# EasyEDA Pro project ProPrj_默语小智管家（ESP32版）_2025-03-15.epro, board PCB_默语小智管家ESP32扩展板
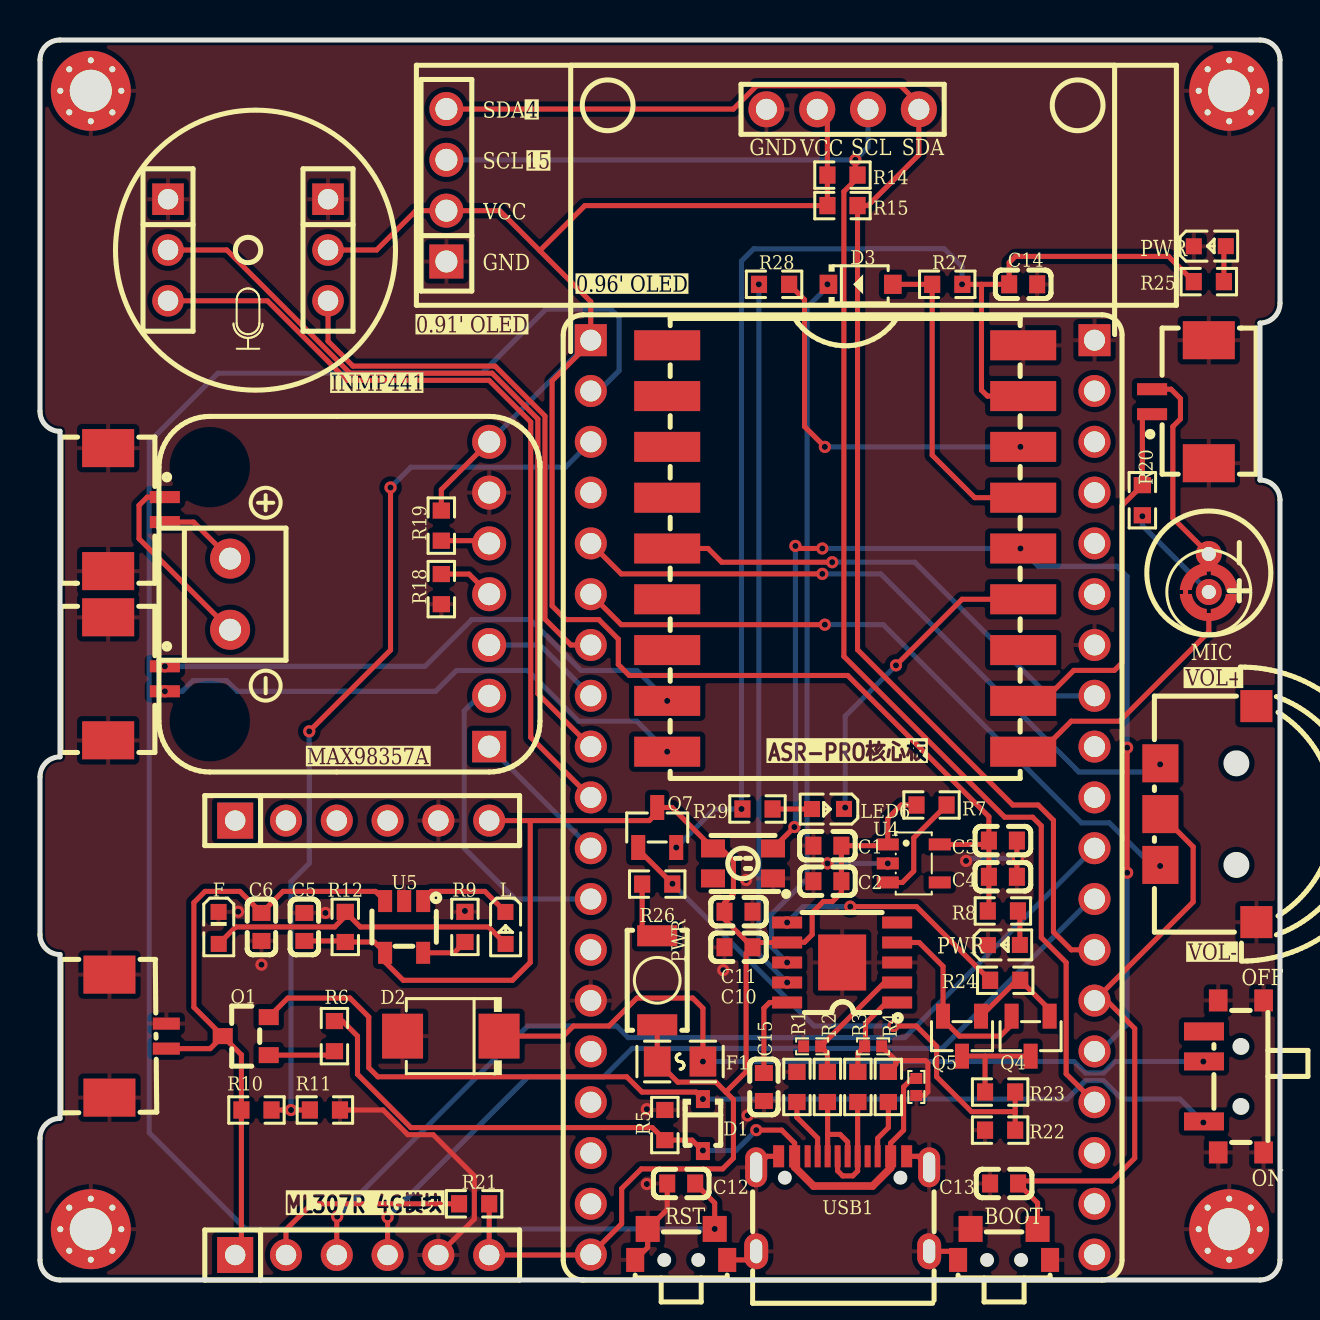
[diagram p5: board, top side]
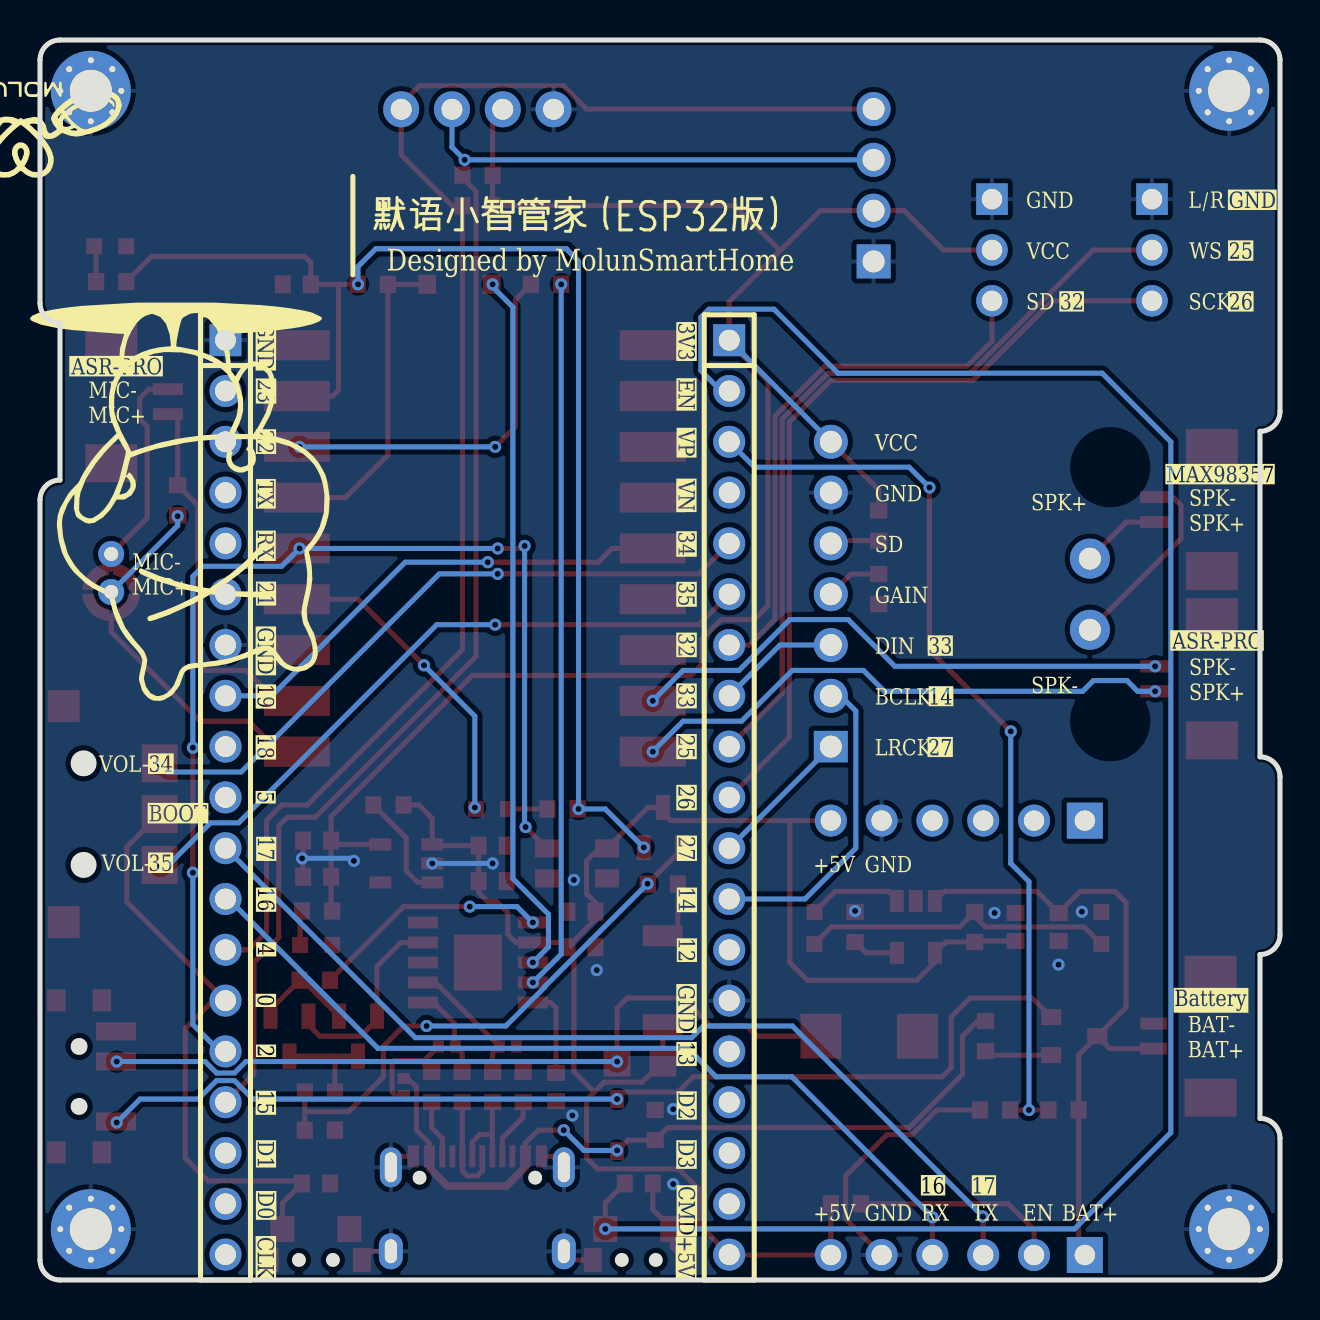
[diagram p6: board, bottom side, seen from below]

Outline 62 x 62 mm; copper layers: Top Layer, Bottom Layer. Coordinates in mm from the lower left corner of the outline.
Outline path: 0,61 0,43.43 arc(0.29,42.73) 1,42.43 1,26.16 arc(0.29,25.86) 0,25.16 0,17.27 arc(0.29,16.56) 1,16.27 1,8.08 arc(0.29,7.79) 0,7.08 0,1 arc(0.29,0.29) 1,0 61,0 arc(61.71,0.29) 62,1 62,39 arc(61.71,39.7) 61,40 61,47.85 arc(61.71,48.14) 62,48.85 62,61 arc(61.71,61.71) 61,62 1,62 arc(0.29,61.71) 0,61
Stack: Top Layer 0.035mm / Dielectric1 1.51mm FR4 er 4.5 / Bottom Layer 0.035mm

## Design rules (mm)
template: JLCPCB Capability(Two Layers Board)
spacing copperThickness1oz (default): track to track 0.102, other pairs 0.152 to 0.3
spacing copperThickness2oz: track to track 0.203, other pairs 0.152 to 0.3
track width copperThickness1oz (default): min 0.127, default 0.254, max 2.54
track width copperThickness2oz: min 0.203, default 0.254, max 2.54
differential pair differentialPair (default): width min 0.127, default 0.254, max 2.54; gap min 0.152, default 0.152
via viaSize (default): diameter min 0.5, default 0.61, max 10; hole min 0.3, default 0.305, max 6.3

## Placement (name value [footprint] x y rotation side)
BOOT1  TS24CA  [SW-SMD_TS24CA]  48.2 1.78 180 top
C1  10uF  [C0603]  39.37 21.72 0 top
C2  100nF  [C0603]  39.37 19.94 180 top
C3  10uF  [C0603]  48.14 21.97 180 top
C4  100nF  [C0603]  48.14 20.16 0 top
C5  4.7uF  [C0603]  13.22 17.65 270 top
C6  10uF  [C0603]  11.07 17.65 90 top
C10  100nF  [C0603]  34.93 16.64 180 top
C11  100nF  [C0603]  34.93 18.42 180 top
C12  100nF  [C0603]  32.06 4.83 180 top
C13  100nF  [C0603]  48.2 4.83 180 top
C14  4.7uF  [C0603]  49.16 49.78 0 top
C15  100nF  [C0603]  36.19 9.65 270 top
CN1  PZ254V-11-19P  [HDR-TH_19P-P2.54-V-M]  27.54 24.13 270 bottom
CN2  PZ254V-11-19P  [HDR-TH_19P-P2.54-V-M]  52.72 24.13 270 bottom
CN3  AFC12-S02DCC-00  [CONN-SMD_AFC12-S02DCC-00]  4.83 38.52 270 top
CN4  AFC12-S02DCC-00  [CONN-SMD_AFC12-S02DCC-00]  4.83 30.06 270 top
CN5  AFC12-S02DCC-00  [CONN-SMD_AFC12-S02DCC-00]  57.02 43.92 90 top
D1  1N5819WS S4  [SOD-323_L1.6-W1.3-LS2.7-RD]  33.15 7.75 270 top
D2  SMBJ5339B  [SMB_L4.6-W3.6-LS5.4-RD]  20.54 12.19 180 top
D3  1N4148W  [SOD-123_L2.7-W1.6-LS3.7-FD]  41.03 49.78 180 top
F  XL-1608PGC-06  [LED0603-RD_GREEN]  8.93 17.6 270 top
F1  BSMD0805-050-6V  [F0805]  32 10.92 180 top
H1  PM254V-11-04-H85  [HDR-TH_4P-P2.54-V-F]  20.32 54.74 90 top
H2  PM254V-11-07-H85  [HDR-TH_7P-P2.54-V-F]  22.46 34.29 90 top
H3  PM254V-11-03-H85  [HDR-TH_3P-P2.54-V-F]  6.4 51.5 270 top
H4  PM254V-11-03-H85  [HDR-TH_3P-P2.54-V-F]  14.4 51.5 270 top
H7  PM254V-11-06-H85  [HDR-TH_6P-P2.54-V-F]  16.11 1.25 0 top
H8  PM254V-11-06-H85  [HDR-TH_6P-P2.54-V-F]  16.11 22.97 0 top
HOLE4  -  [m3 125x300]  2.54 2.54 0 top
HOLE4#2  -  [m3 125x300]  59.46 2.54 0 top
HOLE4#3  -  [m3 125x300]  59.46 59.46 0 top
HOLE4#4  -  [m3 125x300]  2.54 59.46 0 top
L  XL-1608SURC-06  [LED0603-RD_RED]  23.27 17.6 270 top
LED1  XL-1608SURC-06  [LED0603-RD_RED]  48.19 16.75 0 top
LED4  XL-3528RGBW-WS2812B  [LED-SMD_4P-L3.5-W2.8-BR-1]  35.15 20.83 0 top
LED5  XL-1608SURC-06  [LED0603-RD_RED]  58.49 51.69 0 top
LED6  XL-1608SURC-06  [LED0603-RD_RED]  39.4 23.55 180 top
MIC1  GMI6050P-66DB  [MIC-TH_BD6.0-P1.90-D0.4-L-RD]  58.44 35.35 90 top
OLED1  HS91L02W2C01  [OLED-TH_L38.0-W12.0_HS91L02W2C01]  20.32 54.74 0 top
PWR  TS-3425SG  [KEY-SMD_L3.9-W3.0-LS5.0_1]  30.86 14.99 90 top
Q1  AO3401A  [SOT-23_L2.9-W1.3-P1.90-LS2.4-BR]  10.29 12.19 0 top
Q4  SS8550  [SOT-23-3_L2.9-W1.3-P1.90-LS2.4-BR]  49.53 12.19 90 top
Q5  SS8550  [SOT-23-3_L2.9-W1.3-P1.90-LS2.4-BR]  46.1 12.19 90 top
Q7  LP2301LT1G  [SOT-23-3_L2.9-W1.3-P1.90-LS2.4-BR]  30.86 22.62 270 top
R1  5.1kΩ  [R0603]  37.85 9.65 90 top
R2  33Ω  [R0603]  39.37 9.65 90 top
R3  33Ω  [R0603]  40.89 9.65 90 top
R4  5.1kΩ  [R0603]  42.42 9.65 90 top
R5  100kΩ  [R0603]  31.24 7.75 270 top
R6  100kΩ  [R0603]  14.72 12.19 270 top
R7  10kΩ  [R0603]  44.58 23.75 0 top
R8  4.7kΩ  [R0603]  48.14 18.45 0 top
R9  2kΩ  [R0603]  21.25 17.65 270 top
R10  300kΩ  [R0603]  10.82 8.5 0 top
R11  100kΩ  [R0603]  14.25 8.5 0 top
R12  1kΩ  [R0603]  15.26 17.65 270 top
R14  4.7kΩ  [R0603]  40.12 55.25 0 top
R15  4.7kΩ  [R0603]  40.12 53.72 0 top
R18  0Ω  [R0603]  20.07 34.54 90 top
R19  0Ω  [R0603]  20.07 37.72 270 top
R20  0Ω  [R0603]  55.12 38.99 270 top
R21  4.7kΩ  [R0603]  21.71 3.81 180 top
R22  47kΩ  [R0603]  48.01 7.49 0 top
R23  330Ω  [R0603]  48.01 9.4 0 top
R24  2.2kΩ  [R0603]  48.26 14.99 0 top
R25  2.2kΩ  [R0603]  58.44 49.92 180 top
R26  2.2kΩ  [R0603]  30.86 19.8 0 top
R27  4.7kΩ  [R0603]  45.36 49.78 180 top
R28  330Ω  [R0603]  36.7 49.78 180 top
R29  4.7kΩ  [R0603]  35.87 23.55 0 top
RST1  TS24CA  [SW-SMD_TS24CA]  32.06 1.78 180 top
SW1  MK-12C02-G020  [SW-SMD_MK-12C02-G020]  59.69 10.18 90 top
SW3  K1-1502SA-01  [KEY-SMD_K1-1502SA-01]  58.42 23.29 270 top
U1  RCLAMP0521T-ES  [DFN1006-2L-BI]  43.81 9.65 90 top
U2  RCLAMP0521T-ES  [DFN1006-2L-BI]  38.61 11.68 0 top
U3  RCLAMP0521T-ES  [DFN1006-2L-BI]  41.66 11.68 180 top
U4  ME6217C33M5G  [SOT-23-5_L3.0-W1.7-P0.95-LS2.8-BR]  43.69 20.83 180 top
U5  TP4054  [TSOT-23-5_L2.9-W1.6-P0.95-LS2.8-BR]  18.21 17.65 90 top
U7  CH340K  [ESOP-10_L4.9-W3.9-P1.00-LS6.2-BL-EP]  40.11 15.88 90 top
U8  HS96L03W2C03  [OLED-TH_L27.8-W27.2-P2.54_C9900033791]  40.13 58.53 0 top
U10  MAX98357A  [max98357 i2s amp module]  22.46 34.29 180 top
U11  -  [INMP441]  10.4 51.5 0 top
U12  ASRPRO-CORE  [COMM-SMD_ASRPRO-CORE-V1.1]  40.26 36.58 0 top
U13  ESP32-WROVER-IE-N16R8  [MIC-SMD_BD4.0_B4013AM423-008]  58.44 34.4 0 top
USB1  TYPE-C 16PIN 2MD(073)  [USB-C-SMD_TYPE-C-6PIN-2MD-073]  40.13 3.81 0 top
X1  AFC12-S02DCA-00  [SMD_2P-P1.25]  4.89 12.19 270 top

## Footprints (pads in the part's own frame, mm; a bottom-side part is the same pattern mirrored in y, then rotated)
C0603
  rect 0.8x0.9 smd: 1(-0.7,0) 2(0.7,0)
COMM-SMD_ASRPRO-CORE-V1.1
  rect 3.3x1.5 smd: 1(-8.9,10.16) 2(-8.9,7.62) 3(-8.9,5.08) 4(-8.9,2.54) 5(-8.9,0) 6(-8.9,-2.54) 7(-8.9,-5.08) 8(-8.9,-7.62) 9(-8.9,-10.16) 10(8.9,-10.16) 11(8.9,-7.62) 12(8.9,-5.08) 13(8.9,-2.54) 14(8.9,0) 15(8.9,2.54) 16(8.9,5.08) 17(8.9,7.62) 18(8.9,10.16)
CONN-SMD_AFC12-S02DCC-00
  rect 0.6x1.5 smd: 1(-0.625,1.417) 2(0.625,1.417)
  rect 1.9x2.6 smd: 3(3.075,-1.417) 4(-3.075,-1.417)
DFN1006-2L-BI
  rect 0.55x0.6 smd: 1(-0.425,0) 2(0.425,0)
ESOP-10_L4.9-W3.9-P1.00-LS6.2-BL-EP
  rect 0.6x1.5 smd: 1(-2,-2.75) 2(-1,-2.75) 3(0,-2.75) 4(1,-2.75) 5(2,-2.75) 6(2,2.75) 7(1,2.75) 8(0,2.75) 9(-1,2.75) 10(-2,2.75)
  rect 2.8x2.4 smd: 11(0,0)
F0805
  rect 1.335x1.5 smd: 1(-1.143,0) 2(1.143,0)
HDR-TH_3P-P2.54-V-F
  rect 1.575x1.575 hole 1.02: 1(-2.54,0)
  round 1.575 hole 1.02: 2(0,0) 3(2.54,0)
HDR-TH_4P-P2.54-V-F
  rect 1.7x1.7 hole 1.1: 1(-3.81,0)
  round 1.7 hole 1.1: 2(-1.27,0) 3(1.27,0) 4(3.81,0)
HDR-TH_6P-P2.54-V-F
  rect 1.8x1.8 hole 1.02: 1(-6.35,0)
  round 1.6 hole 1.02: 2(-3.81,0) 3(-1.27,0) 4(1.27,0) 5(3.81,0) 6(6.35,0)
HDR-TH_7P-P2.54-V-F
  rect 1.575x1.7 hole 1.1: 1(-7.62,0)
  round 1.7 hole 1.1: 2(-5.08,0) 3(-2.54,0) 4(0,0) 5(2.54,0) 6(5.08,0) 7(7.62,0)
HDR-TH_19P-P2.54-V-M
  rect 1.6x1.6 hole 1.05: 1(-22.86,0)
  round 1.6 hole 1.05: 2(-20.32,0) 3(-17.78,0) 4(-15.24,0) 5(-12.7,0) 6(-10.16,0) 7(-7.62,0) 8(-5.08,0) 9(-2.54,0) 10(0,0) 11(2.54,0) 12(5.08,0) 13(7.62,0) 14(10.16,0) 15(12.7,0) 16(15.24,0) 17(17.78,0) 18(20.32,0) 19(22.86,0)
INMP441
  round 1.524 hole 0.914: 1(4,2.54) 2(4,0) 3(4,-2.54) 4(-4,2.54) 5(-4,0) 6(-4,-2.54)
KEY-SMD_K1-1502SA-01
  rect 1.9x1.8 smd: 1(-2.54,-2.4) 2(2.54,-2.4) T(0,-2.4)
  rect 1.6x1.6 smd: 5(-5.4,2.4) C(5.4,2.4)
KEY-SMD_L3.9-W3.0-LS5.0_1
  rect 1.05x2 smd: 1(-2.225,0) 2(2.225,0)
LED0603-RD_GREEN
  rect 0.8x0.8 smd: 1(-0.799,-0.004) 2(0.799,0.004)
LED0603-RD_RED
  rect 0.8x0.8 smd: 1(-0.799,-0.004) 2(0.799,0.004)
LED-SMD_4P-L3.5-W2.8-BR-1
  rect 1.2x0.9 smd: 1(1.5,-0.75) 2(1.5,0.75) 3(-1.5,0.75) 4(-1.5,-0.75)
m3 125x300
  round 0.61 hole 0.305: 1(-1.524,0) 1(-1.077,-1.077) 2(0,-1.524) 3(1.077,-1.077) 4(1.524,0) 5(1.077,1.077) 6(0,1.524) 7(-1.077,1.077)
  round 4 hole 2.1: 1(0,0)
max98357 i2s amp module
  round 1.524 hole 0.914: 1(0,7.62) 2(0,5.08) 3(0,2.54) 4(0,0) 5(0,-2.54) 6(0,-5.08) 7(0,-7.62)
  round 2 hole 1.1: 8(12.954,-1.778) 9(12.954,1.778)
MIC-SMD_BD4.0_B4013AM423-008
  round 0.9 smd: 1(0,0)
  custom 1.35x1.35 smd: 2(-0.798,0.775) 2(-0.775,-0.798) 2(0.775,0.798) 2(0.798,-0.775)
MIC-TH_BD6.0-P1.90-D0.4-L-RD
  round 1.3 hole 0.7: 1(-0.95,0) 2(0.95,0)
OLED-TH_L27.8-W27.2-P2.54_C9900033791
  round 1.8 hole 1.05: 1(-3.81,0) 2(-1.27,0) 3(1.27,0) 4(3.81,0)
OLED-TH_L38.0-W12.0_HS91L02W2C01
  round 1.6 hole 1: 1(0,-3.81) 2(0,-1.27) 3(0,1.27) 4(0,3.81)
R0603
  rect 0.806x0.864 smd: 1(-0.753,0) 2(0.753,0)
SMB_L4.6-W3.6-LS5.4-RD
  rect 2.047x2.241 smd: 1(-2.413,0) 2(2.413,0)
SMD_2P-P1.25
  rect 0.6x1.35 smd: 1(-0.625,1.421) 2(0.625,1.421)
  rect 1.9x2.6 smd: 3(-3.075,-1.421) 4(3.075,-1.421)
SOD-123_L2.7-W1.6-LS3.7-FD
  rect 0.88x0.96 smd: 1(-1.61,0) 2(1.61,0)
SOD-323_L1.6-W1.3-LS2.7-RD
  rect 0.9x0.7 smd: 1(-1.3,0) 2(1.3,0)
SOT-23-3_L2.9-W1.3-P1.90-LS2.4-BR
  rect 1.25x0.7 smd: 1(1,-0.95) 2(1,0.95) 3(-1,0)
SOT-23-5_L3.0-W1.7-P0.95-LS2.8-BR
  rect 1.1x0.6 smd: 1(1.3,-0.95) 2(1.3,0) 3(1.3,0.95) 4(-1.3,0.95) 5(-1.3,-0.95)
SOT-23_L2.9-W1.3-P1.90-LS2.4-BR
  rect 1x0.8 smd: 1(1.15,-0.95) 2(1.15,0.95) 3(-1.15,0)
SW-SMD_MK-12C02-G020
  rect 0.9x2 smd: 1(-2.25,1.49) 2(0.75,1.49) 3(2.25,1.49)
  rect 1.1x0.93 smd: 4(3.8,0.779) 5(3.8,-1.49) 6(-3.8,-1.49) 7(-3.8,0.779)
SW-SMD_TS24CA
  rect 0.9x1.2 smd: 1(-2.3,0.775) 2(2.3,0.775)
  rect 1.2x1.3 smd: 3(-1.675,-0.775) 4(1.675,-0.775)
TSOT-23-5_L2.9-W1.6-P0.95-LS2.8-BR
  rect 1.1x0.7 smd: 1(1.294,-0.951) 2(1.294,-0.001) 3(1.294,0.951) 4(-1.294,0.951) 5(-1.294,-0.949)
USB-C-SMD_TYPE-C-6PIN-2MD-073
  rect 0.55x1.1 smd: 1(-3.2,2.375) 2(-2.4,2.375) 11(2.4,2.375) 12(3.2,2.375)
  rect 0.3x1.1 smd: 3(-1.75,2.375) 4(-1.25,2.375) 5(-0.75,2.375) 6(-0.25,2.375) 7(0.25,2.375) 8(0.75,2.375) 9(1.25,2.375) 10(1.75,2.375)
  oval 1.1x2 hole 0.6x1.5: 13(-4.325,1.825) 14(4.325,1.825)
  oval 1.2x1.8 hole 0.6x1.2: 13(-4.325,-2.375) 14(4.325,-2.375)

## Nets
+5V: C1.2 C2.1 C5.2 C10.1 C11.2 CN1.19 F1.2 H7.6 H8.6 LED4.3 PWR.1 Q7.3 R7.1 R12.2 R21.1 U4.1 U5.4 U7.7
GND: BOOT1.1 BOOT1.2 BOOT1.4 C1.1 C2.2 C3.1 C4.2 C5.1 C6.1 C10.2 C11.1 C12.2 C13.2 C14.2 C15.2 CN1.14 CN2.1 CN2.7 CN3.3 CN3.4 CN4.3 CN4.4 CN5.3 CN5.4 D2.2 F.1 H1.1 H2.6 H3.1 H4.1 H7.5 H8.5 HOLE4.1 HOLE4.2 HOLE4.3 HOLE4.4 HOLE4.5 HOLE4.6 HOLE4.7 HOLE4#2.1 HOLE4#2.2 HOLE4#2.3 HOLE4#2.4 HOLE4#2.5 HOLE4#2.6 HOLE4#2.7 HOLE4#3.1 HOLE4#3.2 HOLE4#3.3 HOLE4#3.4 HOLE4#3.5 HOLE4#3.6 HOLE4#3.7 HOLE4#4.1 HOLE4#4.2 HOLE4#4.3 HOLE4#4.4 HOLE4#4.5 HOLE4#4.6 HOLE4#4.7 LED1.1 LED4.1 LED5.1 OLED1.1 R1.2 R4.2 R5.1 R9.1 R11.2 R18.1 R22.1 RST1.1 RST1.2 RST1.4 SW1.4 SW1.5 SW1.6 SW1.7 SW3.C U1.1 U2.1 U3.1 U4.2 U5.2 U7.3 U7.11 U8.1 U10.6 U11.1 U11.4 U12.18 USB1.1 USB1.12 USB1.13 USB1.14 X1.1 X1.3 X1.4
VBUS: D1.2 R5.2 R6.1 U1.2 USB1.2 USB1.11
VCC: C3.2 C4.1 CN1.1 H1.2 H2.7 H4.2 OLED1.2 R8.1 R14.1 R15.1 R19.1 U4.5 U8.2 U10.7 U11.2
ASR_MIC+: CN5.1 R20.1 U12.11
ASR_MIC-: CN5.2 MIC1.2 U12.10 U13.2
ASR_MUTE: U12.12
ASR_PA0: U12.7
ASR_PA1: U12.6
ASR_PA2: CN2.8 U12.5
ASR_PA3: U12.4
ASR_PA4: LED6.1 U12.13
ASR_PA5: U12.3
ASR_PA6: U12.2
ASR_PC4: CN2.15 LED4.2 U12.14
ASR_RX0: D3.1 R27.2 U12.15
ASR_SPK+: CN4.2 U12.9
ASR_SPK-: CN4.1 U12.8
ASR_TX0: R28.1 U12.16
BAT+: C6.2 H7.1 Q1.3 R10.1 U5.3 X1.2
BAT_ADC: CN1.3 R10.2 R11.1
BOOT: BOOT1.3 C13.1 CN2.14 SW3.T
D+: R3.2 U3.2 U7.1
D-: R2.2 U2.2 U7.2
DTR: Q4.2 Q5.2 U7.4
EN: C12.1 CN1.2 RST1.3
GAIN: H2.4 R18.2 U10.4
IO1: CN2.4
IO3: CN2.5
IO4: CN2.13 H1.4 OLED1.4 R15.2 U8.4
IO5: CN2.10
IO6: CN2.19
IO7: CN2.18
IO8: CN2.17
IO9: CN1.16
IO10: CN1.17
IO11: CN1.18
IO12: CN1.13
IO13: CN1.15
IO14: CN1.12 H2.2 U10.2
IO15: CN2.16 H1.3 OLED1.3 R14.2 U8.3
IO16: CN2.12 H7.4
IO17: CN2.11 H7.3
IO18: CN2.9
IO21: CN2.6
IO22: CN2.3
IO23: CN2.2
IO25: CN1.9 H3.2 U11.5
IO26: CN1.10 H3.3 U11.6
IO27: CN1.11 H2.1 U10.1
IO32: CN1.7 H4.3 U11.3
IO33: CN1.8 H2.3 U10.3
IO34: CN1.5 SW3.1
IO35: CN1.6 SW3.2
IO39: CN1.4
RTS: R24.1 U7.6
RXD: R28.2 U7.9
SD: H2.5 R19.2 U10.5
TXD: D3.2 U7.8
VOUT: C14.1 Q7.2 R25.2 R27.1 R29.1 U12.17
$1N1838: LED1.2 R8.2
$1N2026: R7.2 U4.3
$1N2780: Q4.1 Q5.1 R24.2
$1N3301: R2.1 USB1.5 USB1.7
$1N3302: R3.1 USB1.6 USB1.8
$1N3308: R4.1 USB1.10
$1N3309: R1.1 USB1.4
$1N3808: F.2 L.2 R12.1
$1N3809: L.1 U5.1
$1N3816: R9.2 U5.5
$1N4189: D2.1 F1.1 SW1.2
$1N4190: D1.1 Q1.2 SW1.1
$1N4194: Q1.1 R6.2
$1N20777: CN3.2 U10.8
$1N20779: CN3.1 U10.9
$1N21045: U12.1
$1N25637: MIC1.1 R20.2 U13.1
$1N33425: H7.2 R21.2
$1N38902: Q4.3 Q5.3 R23.1
$1N38957: Q7.1 R22.2 R23.2 R26.2
$1N39010: C15.1 U7.10
$1N39448: LED5.2 R25.1
$1N39556: PWR.2 R26.1
$1N39986: LED6.2 R29.2

Pads without a net: H8 1 2 3 4; LED4 4; SW1 3; SW3 5; U4 4; U7 5; USB1 3 9

## Via types
v1: diameter 0.61, hole 0.305, Top Layer to Bottom Layer, 57 vias

## Routing (per net, layer and track width the routed paths; a pad name or vN(x,y) marks a point on that pad's centre or on a via; arc(x,y) is an arc through that point)
+5V: length 87.6
  Top Layer w0.254: 24.51,22.97 H8.6 ; 24.51,22.97 24.51,15.88 23.62,14.99 18.16,14.99 17.26,15.89 U5.4 16.72,16.9 R12.2 15.21,16.95 C5.2 ; 24.51,22.97 30.46,22.97 30.86,23.37 Q7.3 31.6,23.62 LED4.3 34.05,21.58 34.67,20.95 34.67,19.3 34.22,18.86 C11.2 34.22,18.04 C10.1 ; R21.1 H7.6 27.52,1.25 CN1.19 29.08,2.81 29.08,4.57 30.07,5.56 34.13,5.56 34.67,6.1 34.67,9.02 34.29,9.4 ; R7.1 43.05,23.75 42.39,23.08 U4.1 42.33,21.72 C1.2 C2.1 40.07,19.37 39.62,18.92 39.17,18.92 38.61,18.36 38.61,17.27 38.23,16.89 37.37,16.89 U7.7 35.86,16.88 C10.1 ; 34.29,9.4 33.8,9.89 31.89,9.89 F1.2 30.86,12.76 ; 34.29,9.4 35.31,10.41 35.31,16.32 C10.1
GND: length 36.2
  Top Layer w0.254: USB1.12 43.91,6.19 USB1.14 ; RST1.1 35.38,1 USB1.13 ; RST1.2 30.39,1.63 30.39,2.55 31.36,3.53 C12.2 ; R11.2 17.16,8.5 18.39,7.26 19.66,7.26 21.72,5.21 21.72,3.05 H7.5 ; R4.2 42.79,10.78 42.79,10.97 ; 42.79,10.97 U3.1 ; 42.79,10.97 44.27,10.97 44.39,10.85 44.39,9.4 44.22,9.23 43.81,9.23 ; BOOT1.2 45.47,1.44 USB1.14 ; USB1.1 36.36,6.19 USB1.13 ; C3.1 C4.2
  Bottom Layer w0.254: v1(39.37,20.83) 42.39,20.83 ; v1(48.9,21.08) 46.43,21.08 v1(46.3,20.95)
  vias: v1(9.91,18.42) v1(11.07,15.77) v1(14.27,18.35) v1(21.25,18.45) v1(30.34,8.54) v1(30.34,4.8) v1(34.16,15.49) v1(35.31,20) v1(35.38,8.23) v1(42.39,20.83)
VBUS: length 39.4
  Top Layer w0.254: D1.2 32.6,6.99 R5.2 30.62,7.62 18.54,7.62 15.88,10.29 15.88,12.19 15.12,12.95 R6.1 ; U1.2 43.61,10.08 43.18,9.65 43.18,7.49 42.53,6.84 USB1.11 ; USB1.2 37.73,6.84 37.08,7.49 v1(35.81,7.49)
  Top Layer w0.381: USB1.2 37.73,5.65 38.68,4.7 41.63,4.7 42.53,5.6 USB1.11
  Bottom Layer w0.254: v1(33.15,6.48) 34.8,6.48 v1(35.81,7.49)
VCC: length 98
  Top Layer w0.254: U8.2 39.37,58.03 R14.1 R15.1 27.25,53.72 24.99,51.47 ; C3.2 C4.1 47.44,18.51 R8.1 ; C3.2 47.25,21.78 U4.5 ; C3.2 47.44,23.17 40.39,30.23 29.46,30.23 28.92,30.77 28.92,32.04 27.94,33.02 26.29,33.02 25.6,33.7 25.6,44.96 27.54,46.89 CN1.1 27.54,48.92 24.99,51.47 ; H2.7 20.07,39.52 R19.1 ; 24.99,51.47 22.99,53.47 OLED1.2 18.8,53.47 16.83,51.5 H4.2
  Bottom Layer w0.254: CN1.1 H2.7
ASR_MIC+: length 19.1
  Top Layer w0.254: U12.11 50.16,28.96 51.69,30.48 53.72,30.48 54.1,30.86 54.1,38.73 R20.1 55.12,43.29 CN5.1
ASR_MIC-: length 29.4
  Top Layer w0.254: 58.41,35.56 58.44,35.59 MIC1.2 56.64,38.1 56.64,42.67 57.02,43.05 57.02,44.07 56.55,44.54 CN5.2 ; 58.41,35.56 58.03,35.56 U13.2 57.28,34.81 57.28,33.78 57.46,33.6 U13.2 57.79,33.47 57.8,33.47 58.05,33.22 58.44,33.22 ; 58.41,35.56 58.85,35.56 U13.2 ; U13.2 59.24,33.58 58.87,33.22 58.44,33.22 ; U12.10 50.04,26.42 51.56,27.94 53.97,27.94 58.44,32.41 58.44,33.22
ASR_PA2: length 24.4
  Top Layer w0.254: v1(39.61,35.89) 34.09,35.89 33.4,36.58 U12.5
  Bottom Layer w0.254: v1(39.61,35.89) 43.74,35.89 50.42,29.21 CN2.8
ASR_PA4: length 15.9
  Top Layer w0.254: v1(42.8,30.73) 46.1,34.04 U12.13
  Bottom Layer w0.254: v1(42.8,30.73) 40.26,28.19 v1(40.26,23.62)
ASR_PC4: length 57.4
  Top Layer w0.254: LED4.2 v1(37.72,22.65) ; v1(54.36,26.62) v1(54.36,20.36) ; v1(37.77,36.7) 37.9,36.58 v1(39.12,36.58)
  Bottom Layer w0.254: v1(39.12,36.58) v1(49.02,36.58) 49.91,35.69 53.85,35.69 54.36,35.18 v1(54.36,26.62) ; v1(54.36,20.36) 54.36,12.77 53.01,11.43 CN2.15 ; v1(37.77,36.7) 37.77,22.7 v1(37.72,22.65)
ASR_RX0: length 15.9
  Top Layer w0.254: U12.15 46.74,39.12 44.61,41.24 R27.2 D3.1
ASR_SPK+: length 27.5
  Bottom Layer w0.254: 31.24,26.54 29.84,27.94 26.92,27.94 24.38,30.48 20.83,30.48 19.78,29.44 9.86,29.44 9.33,29.97 7.65,29.97 7.11,29.44 v1(6.24,29.44)
  vias: v1(31.36,26.42)
ASR_SPK-: length 27.8
  Top Layer w0.254: 31.37,28.96 v1(31.36,28.96)
  Bottom Layer w0.254: 31.37,28.96 29.84,30.48 27.05,30.48 24.51,33.02 21.59,33.02 19.25,30.69 v1(6.24,30.69)
ASR_TX0: length 18.8
  Top Layer w0.254: v1(49.02,41.66) U12.16 ; R28.1 38.23,49.01 38.23,42.67 v1(39.24,41.66)
  Bottom Layer w0.254: v1(39.24,41.66) v1(49.02,41.66)
BAT+: length 32.7
  Top Layer w0.254: U5.3 16.77,19.43 12.15,19.43 11.07,18.35 10,19.43 8.26,19.43 7.69,18.87 7.69,13.64 Q1.3 ; 9.76,1.25 10.07,1.56 R10.1 10.07,11.26 Q1.3 ; Q1.3 8.51,11.57 X1.2
BAT_ADC: length 46.1
  Top Layer w0.254: v1(13.46,27.43) 17.53,31.5 v1(17.53,39.62) ; R10.2 v1(12.55,8.5) R11.1
  Bottom Layer w0.254: v1(12.55,8.5) 12.55,19.92 13.46,20.83 v1(13.46,27.43) ; CN1.3 26.27,40.64 18.54,40.64 v1(17.53,39.62)
BOOT: length 30.1
  Top Layer w0.254: SW3.T 57.66,21.66 57.66,18.9 CN2.14 53.34,13.97 54.74,12.57 54.74,6.1 53.59,4.95 49.03,4.95 C13.1 49.88,3.85 BOOT1.3
D+: length 4.6
  Top Layer w0.254: U7.1 42.32,13.88 41.28,12.83 41.28,11.73 U3.2 40.89,11.35 R3.2
D-: length 6.6
  Top Layer w0.254: R2.2 39.37,11.35 U2.2 42.22,14.88 U7.2
DTR: length 9.9
  Top Layer w0.254: Q4.2 48.58,12.77 48.01,12.19 45.97,12.19 45.15,13.02 Q5.2 45.15,15.68 43.96,16.88 U7.4
EN: length 98.4
  Top Layer w0.254: v1(33.74,2.55) 33.74,3.85 C12.1
  Bottom Layer w0.254: CN1.2 27.94,44.45 28.96,45.47 28.96,48.13 28.55,48.54 25.3,48.54 22.1,45.34 8.89,45.34 5.46,41.91 5.46,7.37 10.27,2.55 v1(33.74,2.55)
GAIN: length 2.8
  Top Layer w0.254: R18.2 21.45,35.3 H2.4
IO4: length 74.7
  Top Layer w0.254: CN2.13 51.56,16.51 50.67,17.4 50.67,22.99 49.91,23.75 48.64,23.75 40.88,31.51 40.88,53.72 41.4,53.72 43.94,56.26 U8.4 43.94,58.8 43.03,59.71 35.83,59.71 34.67,58.55 OLED1.4
IO14: length 15.8
  Bottom Layer w0.254: H2.2 21.97,29.21 21.21,28.45 21.21,21.59 23.75,19.05 CN1.12
IO15: length 76.8
  Top Layer w0.254: 40.77,55.35 40.77,55 40.19,54.42 40.19,31.18 48.24,23.14 49.63,23.14 50.06,22.71 50.06,17.12 51.31,15.88 51.31,10.31 CN2.16 ; 40.77,55.35 40.88,55.25 ; 40.77,55.35 v1(40.77,56.01)
  Bottom Layer w0.254: U8.3 41.4,56.64 v1(40.77,56.01) 20.32,56.01
IO16: length 43.8
  Top Layer w0.254: H7.4 v1(17.38,3.14)
  Bottom Layer w0.254: CN2.12 52.57,19.05 45.11,11.58 29.62,11.58 28.19,10.16 24.4,10.16 v1(17.38,3.14)
IO17: length 47.9
  Top Layer w0.254: v1(14.86,3.18) 14.84,3.16 H7.3
  Bottom Layer w0.254: v1(14.86,3.18) 24.38,12.7 28.83,12.7 29.41,12.12 43.23,12.12 52.71,21.59 CN2.11
IO25: length 39.5
  Top Layer w0.254: CN1.9 24.89,29.32 24.89,43.05 22.61,45.34 15.5,45.34 9.34,51.5 H3.2
IO26: length 40.7
  Top Layer w0.254: CN1.10 24.54,27.13 24.54,42.9 22.45,44.98 15.35,44.98 11.37,48.96 H3.3
IO27: length 7.2
  Bottom Layer w0.254: H2.1 CN1.11
IO32: length 27.4
  Top Layer w0.254: H4.3 14.4,46.94 15.65,45.69 22.75,45.69 25.25,43.2 25.25,33.05 26.54,31.75 CN1.7
IO33: length 6.1
  Bottom Layer w0.254: CN1.8 25,31.75 H2.3
IO34: length 33.4
  Top Layer w0.254: CN1.5 29.06,35.31 v1(39.12,35.31)
  Bottom Layer w0.254: v1(39.12,35.31) 42.04,35.31 51.94,25.4 55.63,25.4 v1(56.01,25.78)
IO35: length 34.1
  Top Layer w0.254: CN1.6 29.06,32.77 v1(39.24,32.77)
  Bottom Layer w0.254: v1(39.24,32.77) 42.16,32.77 52.07,22.86 53.47,22.86 55.63,20.7 v1(56.01,20.7)
RTS: length 12
  Top Layer w0.254: v1(40.51,18.67) 43.82,18.67 R24.1
  Bottom Layer w0.254: v1(40.51,18.67) 38.15,18.67 v1(37.36,17.88)
RXD: length 35.5
  Top Layer w0.254: v1(35.94,49.78) R28.2
  Bottom Layer w0.254: v1(37.36,14.88) 35.94,16.29 v1(35.94,49.78)
SD: length 2.4
  Top Layer w0.254: R19.2 22.32,36.97 H2.5
TXD: length 35.4
  Bottom Layer w0.254: v1(39.37,49.78) 39.37,49.66 38.35,48.64 38.35,20.07 36.58,18.29 36.58,16.66 v1(37.36,15.88)
VOUT: length 64.8
  Top Layer w0.254: v1(46.1,49.78) 47.07,49.78 ; 47.07,49.78 47.07,44.49 47.37,44.2 U12.17 ; 47.07,49.78 48.46,49.78 48.46,50.87 48.77,51.18 56.43,51.18 R25.2
  Bottom Layer w0.254: v1(46.1,49.78) 46.1,50.67 45.21,51.56 35.69,51.56 35.07,50.95 v1(35.07,23.55) 33.74,23.55 v1(31.81,21.62)
$1N1838: length 1.7
  Top Layer w0.254: R8.2 48.99,18.36 LED1.2
$1N2026: length 5.5
  Top Layer w0.254: U4.3 43.12,19.88 43.69,20.45 43.69,22.11 R7.2
$1N2780: length 5.1
  Top Layer w0.254: Q4.1 50.48,13.52 R24.2 48.84,14.99 Q5.1
$1N3301: length 4.6
  Top Layer w0.254: USB1.5 39.38,7.28 ; 39.38,7.28 39.38,8.89 R2.1 ; 39.38,7.28 40,7.28 40.38,6.9 USB1.7
$1N3302: length 5.4
  Top Layer w0.254: R3.1 40.88,8.89 USB1.8 40.88,5.45 40.64,5.21 40.13,5.21 39.88,5.46 USB1.6
$1N3308: length 2.9
  Top Layer w0.254: R4.1 42.42,7.62 41.88,7.08 USB1.10
$1N3309: length 3.1
  Top Layer w0.254: USB1.4 38.88,7.09 37.85,8.13 R1.1
$1N3808: length 15.8
  Top Layer w0.254: L.2 22.43,17.65 16.02,17.65 R12.1 15.26,18.18 14.73,17.65 9.79,17.65 F.2
$1N3809: length 4.8
  Top Layer w0.254: 23.27,18.4 22.24,19.43 19.56,19.43 19.16,19.03 U5.1
$1N3816: length 2.3
  Top Layer w0.254: U5.5 20.71,16.36 R9.2
$1N4189: length 39.4
  Top Layer w0.254: D2.1 26.16,12.19 26.67,12.7 28.45,12.7 29.84,14.1 32.64,14.1 33.15,13.59 v1(33.15,10.92)
  Bottom Layer w0.254: v1(58.17,10.92) 53.74,10.92 53.17,10.35 52.28,10.35 51.71,10.92 v1(33.15,10.92)
$1N4190: length 52
  Top Layer w0.254: Q1.2 12.39,14.1 15.49,14.1 16.44,13.15 16.44,10.61 16.89,10.16 29.34,10.16 30.1,9.4 32.8,9.4 v1(33.15,9.05)
  Bottom Layer w0.254: v1(33.15,9.05) 51.36,9.05 52.28,9.97 53.17,9.97 54.09,9.05 56.99,9.05 v1(58.17,7.87)
$1N4194: length 3.4
  Top Layer w0.254: Q1.1 14.53,11.24 R6.2
$1N20777: length 4
  Top Layer w0.254: CN3.2 7.68,37.89 9.51,36.07
$1N20779: length 9.6
  Top Layer w0.254: CN3.1 5.36,39.14 4.95,38.73 4.95,37.06 9.51,32.51
$1N25637: length 5.2
  Bottom Layer w0.254: MIC1.1 55.12,37.72 v1(55.12,38.19)
$1N33425: length 10.5
  Top Layer w0.254: R21.2 13.59,3.81 12.3,2.52 H7.2
$1N38902: length 5.2
  Top Layer w0.254: Q5.3 Q4.3 ; R23.1 47.25,11.19
$1N38957: length 27.3
  Top Layer w0.254: v1(31.62,19.81) 30.16,21.27 29.91,21.27 29.91,21.62 ; 48.76,8.42 46.57,8.42 44.83,10.16 44.83,11.68 43.81,12.7 v1(42.67,12.7) ; 48.76,8.42 R23.2 ; 48.76,8.42 R22.2
  Bottom Layer w0.254: v1(31.62,19.81) 36.77,14.66 36.77,14.63 38.71,12.7 v1(42.67,12.7)
$1N39010: length 4.5
  Top Layer w0.254: U7.10 36.48,13.88 36.19,13.59 C15.1
$1N39448: length 1.8
  Top Layer w0.254: R25.1 59.19,51.6 LED5.2
$1N39556: length 3.1
  Top Layer w0.254: R26.1 30.11,17.64 30.54,17.21 PWR.2
$1N39986: length 2
  Top Layer w0.254: R29.2 38.6,23.55 LED6.2

## Copper pours and planes (outline as drawn; the poured copper is in the pictures)
GND on Top Layer: -26.67,87.25 90.3,87.25 90.3,-27.94 -26.67,-27.94
GND on Bottom Layer: -14.6,76.33 75.82,76.33 75.82,-12.95 -14.6,-12.95

## Text on the board
Bottom Silkscreen Layer: Designed by MolunSmartHome | 默语小智管家（ESP32版） | 14 | CMD | 27 | 12 | EN | 3V3 | VP | VN | 34 | 35 | 32 | 33 | 25 | 26 | GND | 13 | D2 | D3 | +5V | 16 | D0 | 17 | 4 | 23 | 22 | TX | RX | 21 | 19 | 18 | 5 | 0 | 2 | 15 | D1 | CLK | SPK- | SPK+ | BAT- | BAT+ | Battery | ASR-PRO | MAX98357 | VCC | SD | GAIN | DIN | BCLK | LRCK | MIC- | MIC+ | WS | SCK | L/R | BOOT | VOL- | VOL+
Top Silkscreen Layer: OFF | ON | SDA | SCL | GND | VCC | 4 | 15 | ASR-PRO核心板 | PWR | VOL+ | VOL- | ML307R 4G模块 | MAX98357A | INMP441 | 0.91' OLED | 0.96' OLED | RST | BOOT | MIC
